# EAGLE design lf (EAGLE 9.2.2)
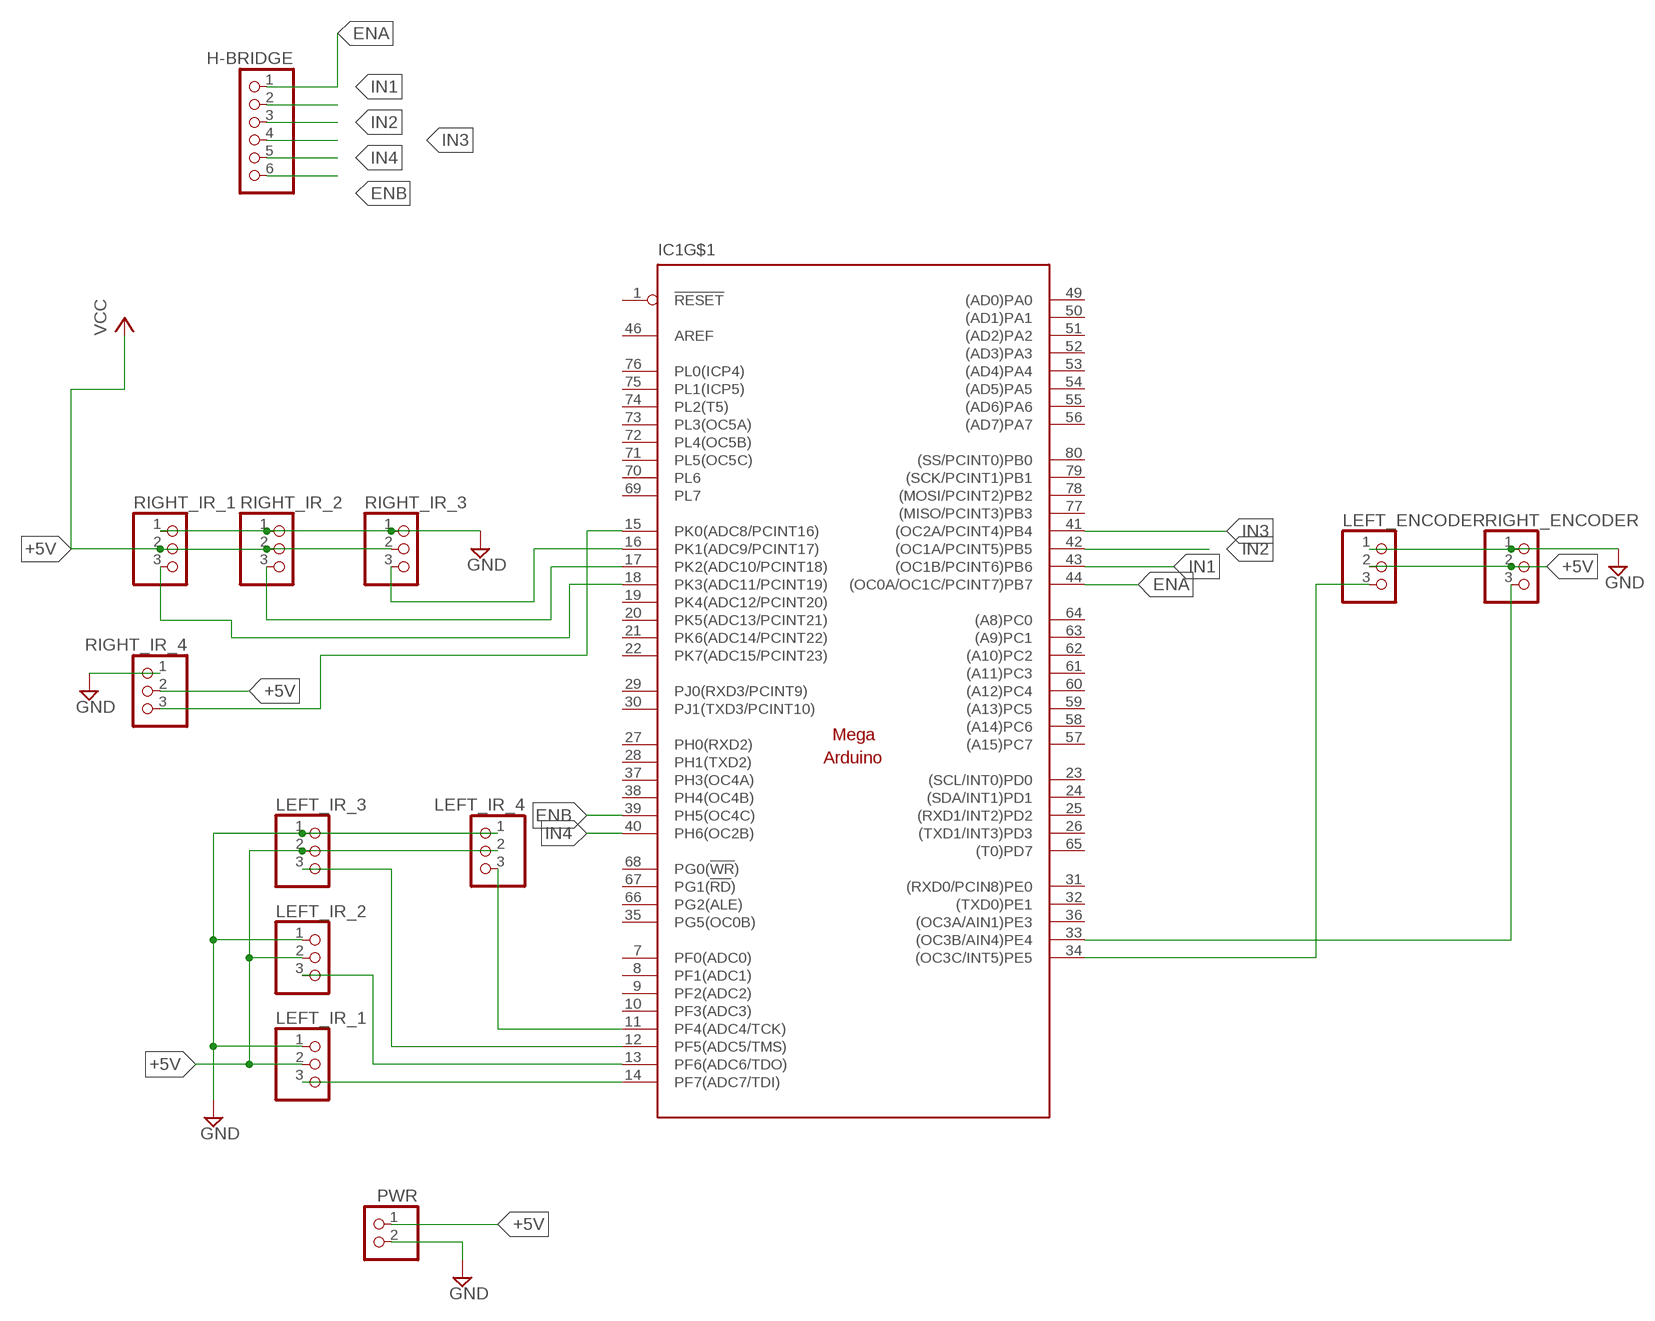
[diagram p0: schematic, sheet 1]

## Parts
H-BRIDGE  PINHD-1X6  [1X06]
IC1  MEGAARDUINO_22  [MEGA_ARDUINO_2]
LEFT_ENCODER  PINHD-1X3  [1X03]
LEFT_IR_1  PINHD-1X3  [1X03]
LEFT_IR_2  PINHD-1X3  [1X03]
LEFT_IR_3  PINHD-1X3  [1X03]
LEFT_IR_4  PINHD-1X3  [1X03]
PWR  PINHD-1X2  [1X02]
RIGHT_ENCODER  PINHD-1X3  [1X03]
RIGHT_IR_1  PINHD-1X3  [1X03]
RIGHT_IR_2  PINHD-1X3  [1X03]
RIGHT_IR_3  PINHD-1X3  [1X03]
RIGHT_IR_4  PINHD-1X3  [1X03]

## Nets
+5V: LEFT_ENCODER.2 LEFT_IR_1.2 LEFT_IR_2.2 LEFT_IR_3.2 LEFT_IR_4.2 PWR.1 RIGHT_ENCODER.2 RIGHT_IR_1.2 RIGHT_IR_2.2 RIGHT_IR_3.2 RIGHT_IR_4.2 ; supply symbol labelled VCC
ENA: H-BRIDGE.1 IC1.44((OC0A/OC1C/PCINT7)PB7)
ENB: H-BRIDGE.6 IC1.39(PH5(OC4C))
GND: LEFT_ENCODER.1 LEFT_IR_1.1 LEFT_IR_2.1 LEFT_IR_3.1 LEFT_IR_4.1 PWR.2 RIGHT_ENCODER.1 RIGHT_IR_1.1 RIGHT_IR_2.1 RIGHT_IR_3.1 RIGHT_IR_4.1
IN1: H-BRIDGE.2 IC1.43((OC1B/PCINT6)PB6)
IN2: H-BRIDGE.3 IC1.42((OC1A/PCINT5)PB5)
IN3: H-BRIDGE.4 IC1.41((OC2A/PCINT4)PB4)
IN4: H-BRIDGE.5 IC1.40(PH6(OC2B))
N$1: IC1.16(PK1(ADC9/PCINT17)) RIGHT_IR_3.3
N$2: IC1.17(PK2(ADC10/PCINT18)) RIGHT_IR_2.3
N$3: IC1.33((OC3B/AIN4)PE4) RIGHT_ENCODER.3
N$4: IC1.34((OC3C/INT5)PE5) LEFT_ENCODER.3
N$5: IC1.14(PF7(ADC7/TDI)) LEFT_IR_1.3
N$6: IC1.13(PF6(ADC6/TDO)) LEFT_IR_2.3
N$7: IC1.12(PF5(ADC5/TMS)) LEFT_IR_3.3
N$8: IC1.18(PK3(ADC11/PCINT19)) RIGHT_IR_1.3
N$9: IC1.15(PK0(ADC8/PCINT16)) RIGHT_IR_4.3
N$10: IC1.11(PF4(ADC4/TCK)) LEFT_IR_4.3
Unconnected: IC1.1(!RESET) IC1.7(PF0(ADC0)) IC1.8(PF1(ADC1)) IC1.9(PF2(ADC2)) IC1.10(PF3(ADC3)) IC1.19(PK4(ADC12/PCINT20)) IC1.20(PK5(ADC13/PCINT21)) IC1.21(PK6(ADC14/PCINT22)) IC1.22(PK7(ADC15/PCINT23)) IC1.23((SCL/INT0)PD0) IC1.24((SDA/INT1)PD1) IC1.25((RXD1/INT2)PD2) IC1.26((TXD1/INT3)PD3) IC1.27(PH0(RXD2)) IC1.28(PH1(TXD2)) IC1.29(PJ0(RXD3/PCINT9)) IC1.30(PJ1(TXD3/PCINT10)) IC1.31((RXD0/PCIN8)PE0) IC1.32((TXD0)PE1) IC1.35(PG5(OC0B)) IC1.36((OC3A/AIN1)PE3) IC1.37(PH3(OC4A)) IC1.38(PH4(OC4B)) IC1.46(AREF) IC1.49((AD0)PA0) IC1.50((AD1)PA1) IC1.51((AD2)PA2) IC1.52((AD3)PA3) IC1.53((AD4)PA4) IC1.54((AD5)PA5) IC1.55((AD6)PA6) IC1.56((AD7)PA7) IC1.57((A15)PC7) IC1.58((A14)PC6) IC1.59((A13)PC5) IC1.60((A12)PC4) IC1.61((A11)PC3) IC1.62((A10)PC2) IC1.63((A9)PC1) IC1.64((A8)PC0) IC1.65((T0)PD7) IC1.66(PG2(ALE)) IC1.67(PG1(!RD!)) IC1.68(PG0(!WR!)) IC1.69(PL7) IC1.70(PL6) IC1.71(PL5(OC5C)) IC1.72(PL4(OC5B)) IC1.73(PL3(OC5A)) IC1.74(PL2(T5)) IC1.75(PL1(ICP5)) IC1.76(PL0(ICP4)) IC1.77((MISO/PCINT3)PB3) IC1.78((MOSI/PCINT2)PB2) IC1.79((SCK/PCINT1)PB1) IC1.80((SS/PCINT0)PB0)

## Power pins joined to a net without a drawn wire
+3V3: IC1.2(+3V3)
+5V: IC1.3(+5V) IC1.47(+5V) IC1.48(+5V)
+VIN: IC1.6(+VIN)
GND: IC1.4(GND) IC1.5(GND) IC1.45(GND) IC1.81(GND) IC1.82(GND)

## Library data of the parts
H-BRIDGE = adafruit:PINHD-1X6: PIN HEADER
IC1 = arduino:MEGAARDUINO_2: The Arduino Mega is a microcontroller board based on the ATmega1280. - 54 digital input/output pins (of which 14 can be used as PWM outputs) - 16 analog inputs - 4 UARTs (hardware serial ports) - 16 MHz crystal oscillator - USB connection - power jack - ICSP header - reset button It contains everything needed to support the microcontroller; simply connect it to a computer with a USB cable or power it with a AC-to-DC adapter or battery to get started. The Mega is compatible with most shields designed for the Arduino Duemilanove or Diecimila. http://arduino.cc/en/Main/ArduinoBoardMega
LEFT_ENCODER LEFT_IR_1-LEFT_IR_4 RIGHT_ENCODER RIGHT_IR_1-RIGHT_IR_4 = adafruit:PINHD-1X3: PIN HEADER
PWR = pinhead:PINHD-1X2: PIN HEADER

## Net classes
0 default: width 0.305 mm, drill 0.508 mm, clearance 0.254 mm

## Board
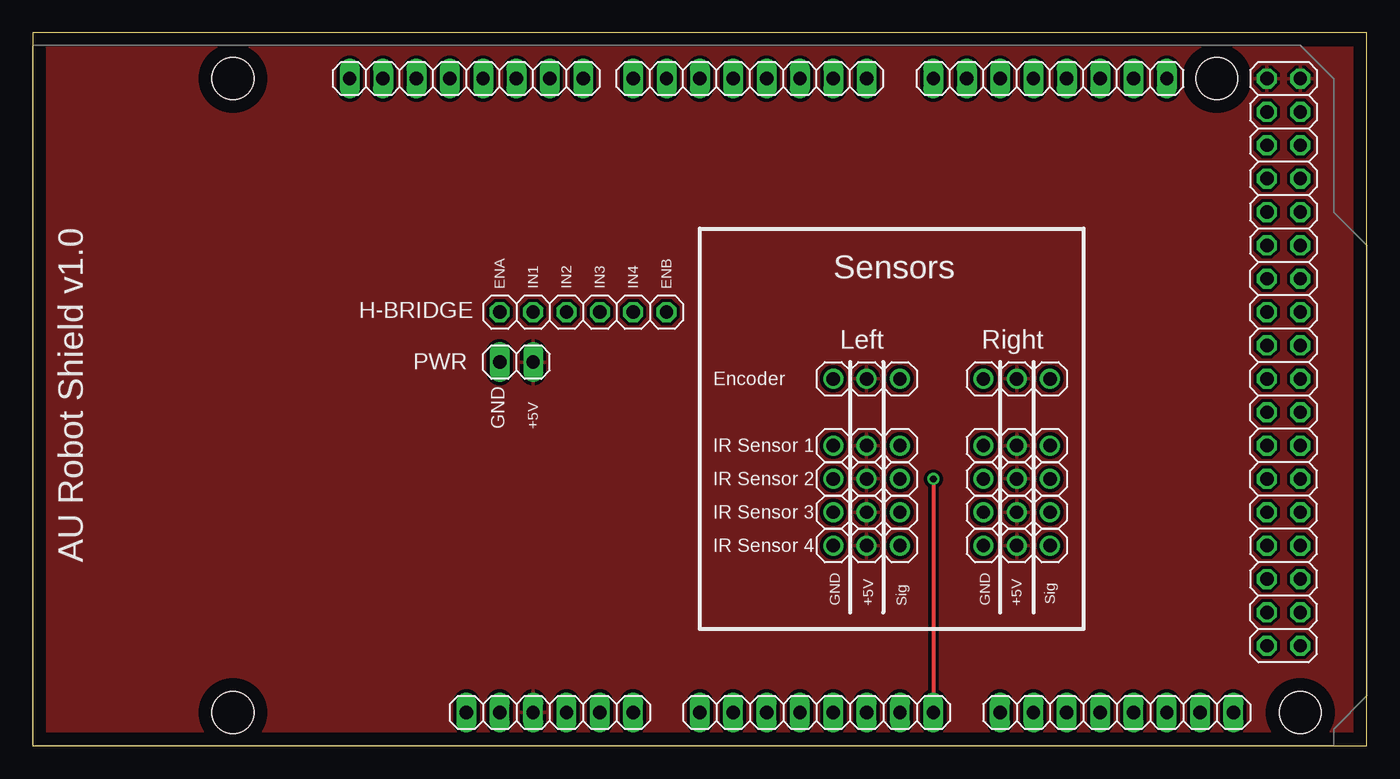
[diagram p1: board, top side]
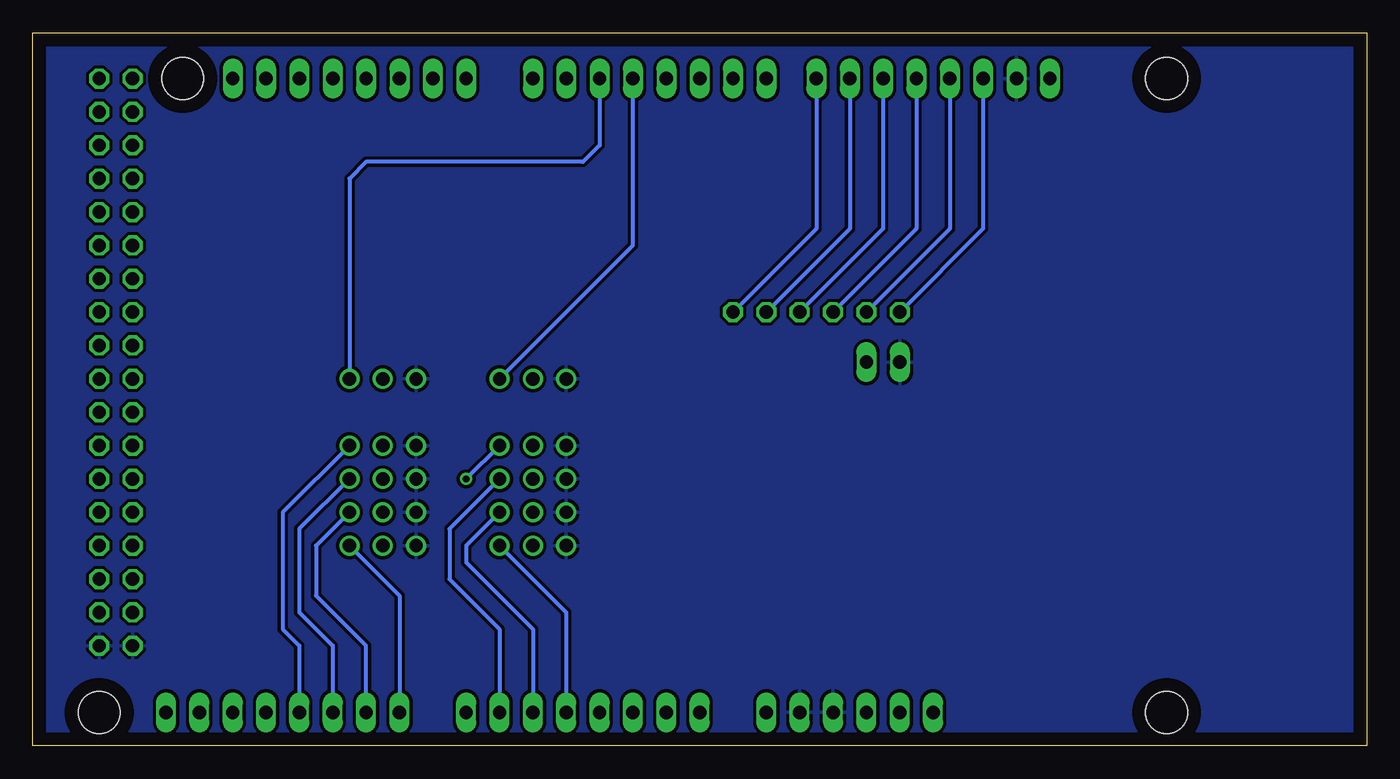
[diagram p2: board, bottom side, seen from below]

Size 101.58 x 54.28 mm. Coordinates in mm from the lower left corner, seen from the top.
Outline: 0,0 101.58,0 101.58,54.28 0,54.28 0,0
Copper layers (1*16): Top 0.035mm / dielectric 1.5mm / Bottom 0.035mm
Design rules "default": minimum track width 6mil, minimum drill 0.35mm, track to track 6mil, track to pad 6mil, pad to pad 6mil, via to via 6mil, smd to smd 6mil, copper to edge 40mil, drill to drill 6mil, minimum pad ring 10mil, minimum via ring 8mil, stop-mask expansion 4mil, vias tented up to drill 0mil, thermal gap 10mil

### Footprints (pad centres in the part's own frame; a part is rotated, then mirrored left to right if it is on the bottom)
1X06 = drill 1.016 octagon: 1 -6.35,0; 2 -3.81,0; 3 -1.27,0; 4 1.27,0; 5 3.81,0; 6 6.35,0
MEGA_ARDUINO_2 = drill 1.016 long: 1 33.02,2.54; 2 35.56,2.54; 3 38.1,2.54; 4 40.64,2.54; 5 43.18,2.54; 6 45.72,2.54; 7 50.8,2.54; 8 53.34,2.54; 9 55.88,2.54; 10 58.42,2.54; 11 60.96,2.54; 12 63.5,2.54; 13 66.04,2.54; 14 68.58,2.54; 15 73.66,2.54; 16 76.2,2.54; 17 78.74,2.54; 18 81.28,2.54; 19 83.82,2.54; 20 86.36,2.54; 21 88.9,2.54; 22 91.44,2.54; 23 86.36,50.8; 24 83.82,50.8; 25 81.28,50.8; 26 78.74,50.8; 27 76.2,50.8; 28 73.66,50.8; 29 71.12,50.8; 30 68.58,50.8; 31 63.5,50.8; 32 60.96,50.8; 33 58.42,50.8; 34 55.88,50.8; 35 53.34,50.8; 36 50.8,50.8; 37 48.26,50.8; 38 45.72,50.8; 39 41.91,50.8; 40 39.37,50.8; 41 36.83,50.8; 42 34.29,50.8; 43 31.75,50.8; 44 29.21,50.8; 45 26.67,50.8; 46 24.13,50.8 | drill 1.016 octagon: 47 93.98,50.8; 48 96.52,50.8; 49 93.98,48.26; 50 96.52,48.26; 51 93.98,45.72; 52 96.52,45.72; 53 93.98,43.18; 54 96.52,43.18; 55 93.98,40.64; 56 96.52,40.64; 57 93.98,38.1; 58 96.52,38.1; 59 93.98,35.56; 60 96.52,35.56; 61 93.98,33.02; 62 96.52,33.02; 63 93.98,30.48; 64 96.52,30.48; 65 93.98,27.94; 66 96.52,27.94; 67 93.98,25.4; 68 96.52,25.4; 69 93.98,22.86; 70 96.52,22.86; 71 93.98,20.32; 72 96.52,20.32; 73 93.98,17.78; 74 96.52,17.78; 75 93.98,15.24; 76 96.52,15.24; 77 93.98,12.7; 78 96.52,12.7; 79 93.98,10.16; 80 96.52,10.16; 81 93.98,7.62; 82 96.52,7.62 | hole 3.2: 15.24,50.8; 15.24,2.54; 90.17,50.8; 96.52,2.54
1X03 = drill 1.016: 1 -2.54,0; 2 0,0; 3 2.54,0
1X02 = drill 1.016 long: 1 -1.27,0; 2 1.27,0

### Placement (x,y rotation side)
H-BRIDGE  41.91,33.02 0 top
IC1  0,0 0 top
LEFT_ENCODER  63.5,27.94 0 top
LEFT_IR_1  63.5,22.86 0 top
LEFT_IR_2  63.5,20.32 0 top
LEFT_IR_3  63.5,17.78 0 top
LEFT_IR_4  63.5,15.24 0 top
PWR  36.83,29.21 180 top
RIGHT_ENCODER  74.93,27.94 0 top
RIGHT_IR_1  74.93,22.86 0 top
RIGHT_IR_2  74.93,20.32 0 top
RIGHT_IR_3  74.93,17.78 0 top
RIGHT_IR_4  74.93,15.24 0 top

### Tracks (layer width: path | path; a pad name or v marks a point on that pad's centre or on a via)
+5V
  pour Top: 0,0 0,53.34 101.6,53.34 101.6,0
ENA
  Bottom 0.305: IC1.44 29.21,39.37 H-BRIDGE.1
ENB
  Bottom 0.305: IC1.39 41.91,39.37 H-BRIDGE.6
GND
  pour Bottom: 0,0 0,53.34 101.6,53.34 101.6,0
IN1
  Bottom 0.305: IC1.43 31.75,39.37 H-BRIDGE.2
IN2
  Bottom 0.305: IC1.42 34.29,39.37 H-BRIDGE.3
IN3
  Bottom 0.305: IC1.41 36.83,39.37 H-BRIDGE.4
IN4
  Bottom 0.305: IC1.40 39.37,39.37 H-BRIDGE.5
N$1
  Bottom 0.305: IC1.16 76.2,7.62 80.01,11.43 80.01,15.24 RIGHT_IR_3.3
N$2
  Bottom 0.305: IC1.17 78.74,7.62 81.28,10.16 81.28,16.51 RIGHT_IR_2.3
N$3
  Bottom 0.305: IC1.33 58.42,45.72 59.69,44.45 76.2,44.45 77.47,43.18 RIGHT_ENCODER.3
N$4
  Bottom 0.305: LEFT_ENCODER.3 55.88,38.1 IC1.34
N$5  (via drill 0.51)
  Top 0.305: v68.58,20.32 IC1.14
  Bottom 0.305: LEFT_IR_1.3 v68.58,20.32
N$6
  Bottom 0.305: LEFT_IR_2.3 69.85,16.51 69.85,12.7 66.04,8.89 IC1.13
N$7
  Bottom 0.305: LEFT_IR_3.3 68.58,15.24 68.58,13.97 63.5,8.89 IC1.12
N$8
  Bottom 0.305: IC1.18 81.28,7.62 82.55,8.89 82.55,17.78 RIGHT_IR_1.3
N$9
  Bottom 0.305: IC1.15 73.66,11.43 RIGHT_IR_4.3
N$10
  Bottom 0.305: LEFT_IR_4.3 60.96,10.16 IC1.11

### Text on the board
tNames: Sensors | ENA | IN1 | IN2 | IN3 | IN4 | ENB | Left | Right | Encoder | GND | +5V | IR Sensor 1 | IR Sensor 2 | IR Sensor 3 | IR Sensor 4 | AU Robot Shield v1.0 | GND | +5V | Sig | GND | +5V | Sig